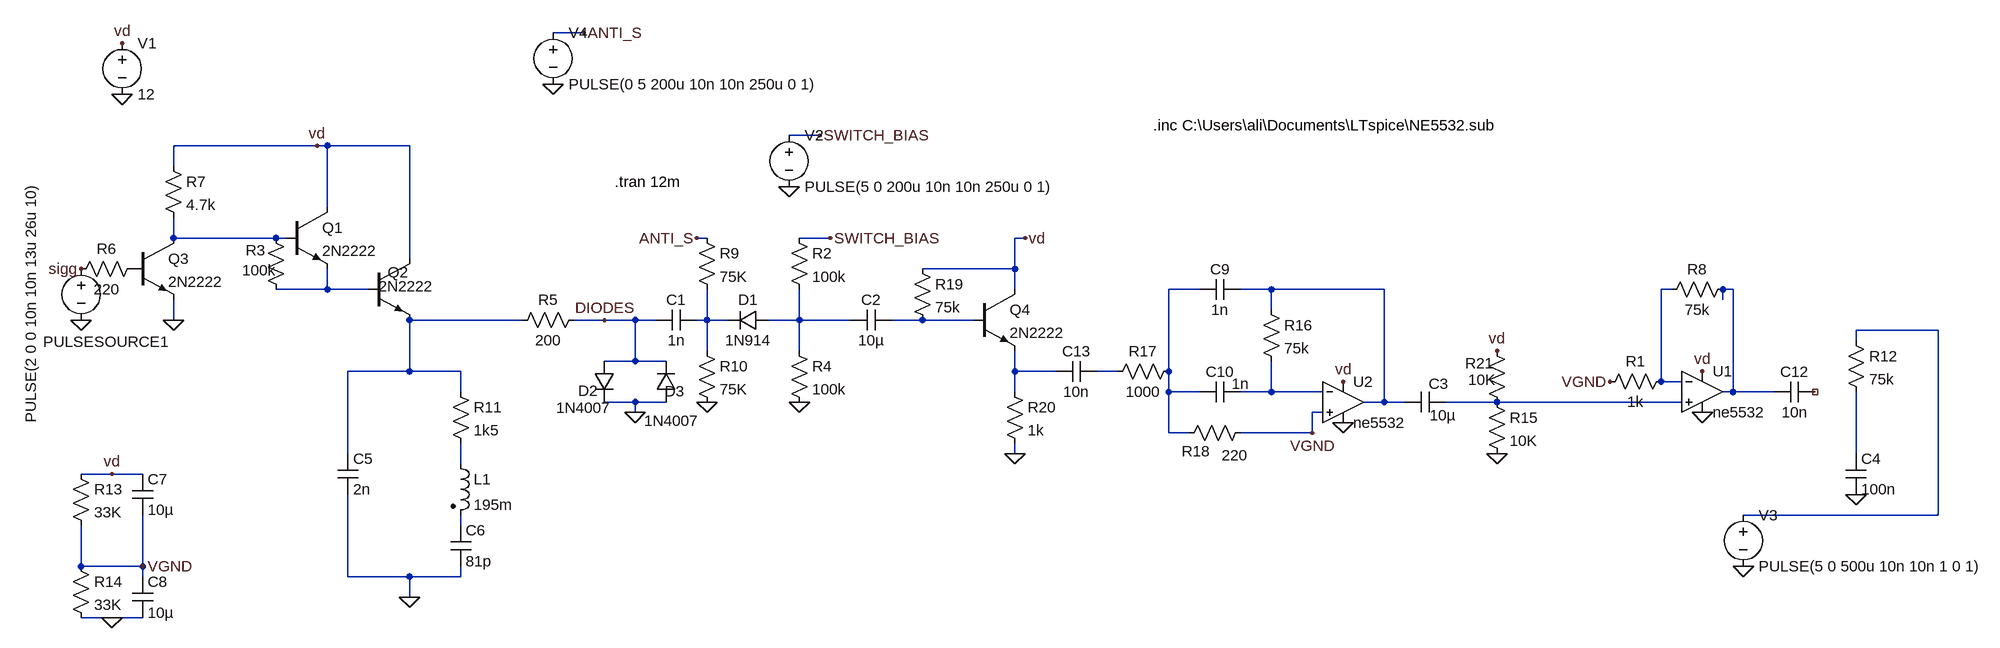
[diagram p0: schematic circuit.asc]
circuit.asc, the LTspice schematic file:
Version 4
SHEET 1 3708 852
WIRE 160 -416 112 -416
WIRE 528 -256 480 -256
WIRE -256 -240 -480 -240
WIRE -240 -240 -256 -240
WIRE -112 -240 -240 -240
WIRE -480 -208 -480 -240
WIRE -240 -144 -240 -240
WIRE -480 -96 -480 -128
WIRE -320 -96 -480 -96
WIRE -304 -96 -320 -96
WIRE 352 -96 336 -96
WIRE 544 -96 496 -96
WIRE 848 -96 832 -96
WIRE -112 -64 -112 -240
WIRE 832 -48 832 -96
WIRE 832 -48 688 -48
WIRE -240 -16 -240 -48
WIRE -240 -16 -320 -16
WIRE -176 -16 -240 -16
WIRE 832 -16 832 -48
WIRE 1120 -16 1072 -16
WIRE 1232 -16 1184 -16
WIRE 1408 -16 1232 -16
WIRE 1856 -16 1840 -16
WIRE 1952 -16 1936 -16
WIRE 1936 0 1936 -16
WIRE 1232 16 1232 -16
WIRE -480 32 -480 0
WIRE 64 32 -112 32
WIRE 192 32 144 32
WIRE 240 32 192 32
WIRE 272 32 240 32
WIRE 352 32 352 -16
WIRE 352 32 336 32
WIRE 384 32 352 32
WIRE 496 32 496 -16
WIRE 496 32 448 32
WIRE 576 32 496 32
WIRE 688 32 640 32
WIRE 768 32 688 32
WIRE 2272 48 2144 48
WIRE 2144 64 2144 48
WIRE 352 80 352 32
WIRE 496 80 496 32
WIRE 240 96 240 32
WIRE 240 96 192 96
WIRE 288 96 240 96
WIRE -112 112 -112 32
WIRE -112 112 -208 112
WIRE -32 112 -112 112
WIRE 832 112 832 80
WIRE 896 112 832 112
WIRE 992 112 960 112
WIRE 1072 112 1072 -16
WIRE 1840 128 1840 -16
WIRE 1872 128 1840 128
WIRE -32 144 -32 112
WIRE 832 144 832 112
WIRE 1072 144 1072 112
WIRE 1120 144 1072 144
WIRE 1232 144 1232 96
WIRE 1232 144 1184 144
WIRE 1312 144 1232 144
WIRE 1952 144 1952 -16
WIRE 1952 144 1936 144
WIRE 2016 144 1952 144
WIRE 240 160 192 160
WIRE 288 160 240 160
WIRE 1408 160 1408 -16
WIRE 1408 160 1376 160
WIRE 1440 160 1408 160
WIRE 1584 160 1504 160
WIRE 1872 160 1584 160
WIRE 240 176 240 160
WIRE 1312 176 1296 176
WIRE 1072 208 1072 144
WIRE 1104 208 1072 208
WIRE 1296 208 1296 176
WIRE 1296 208 1184 208
WIRE -208 240 -208 112
WIRE 832 240 832 224
WIRE 2144 240 2144 144
WIRE -32 256 -32 224
WIRE -576 272 -624 272
WIRE -528 272 -576 272
WIRE 2272 336 2272 48
WIRE 2272 336 1968 336
WIRE -32 352 -32 336
WIRE -624 416 -624 352
WIRE -528 416 -528 336
WIRE -528 416 -624 416
WIRE -528 432 -528 416
WIRE -208 432 -208 304
WIRE -112 432 -208 432
WIRE -32 432 -32 416
WIRE -32 432 -112 432
WIRE -112 464 -112 432
WIRE -576 496 -624 496
WIRE -528 496 -576 496
FLAG -560 -320 0
FLAG -560 -400 vd
FLAG -624 32 0
FLAG 544 -96 SWITCH_BIAS
FLAG 480 -176 0
FLAG 848 -96 vd
FLAG 496 160 0
FLAG 528 -256 SWITCH_BIAS
FLAG 240 176 0
FLAG -480 32 0
FLAG 352 160 0
FLAG -112 464 0
FLAG -624 -48 sigg
FLAG 192 32 DIODES
FLAG 1344 192 0
FLAG 1296 208 VGND
FLAG 832 240 0
FLAG 1904 176 0
FLAG 1760 128 VGND
FLAG 112 -336 0
FLAG 160 -416 ANTI_S
FLAG 336 -96 ANTI_S
FLAG 1344 128 vd
FLAG 1904 112 vd
FLAG -576 496 0
FLAG -576 272 vd
FLAG -528 416 VGND
FLAG 1584 240 0
FLAG 1584 80 vd
FLAG -256 -240 vd
FLAG 1968 416 0
FLAG 2144 304 0
SYMBOL voltage -560 -416 R0
WINDOW 123 0 0 Left 0
WINDOW 39 0 0 Left 0
SYMATTR InstName V1
SYMATTR Value 12
SYMBOL npn -304 -144 R0
SYMATTR InstName Q1
SYMATTR Value 2N2222
SYMBOL voltage -624 -64 R0
WINDOW 0 -59 130 Left 2
WINDOW 3 -79 -115 VRight 2
WINDOW 123 0 0 Left 0
WINDOW 39 0 0 Left 0
SYMATTR InstName PULSESOURCE1
SYMATTR Value PULSE(2 0 0 10n 10n 13u 26u 10)
SYMBOL npn -176 -64 R0
WINDOW 0 30 21 Left 2
WINDOW 3 16 43 Left 2
SYMATTR InstName Q2
SYMATTR Value 2N2222
SYMBOL voltage 480 -272 R0
WINDOW 123 0 0 Left 0
WINDOW 39 0 0 Left 0
SYMATTR InstName V2
SYMATTR Value PULSE(5 0 200u 10n 10n 250u 0 1)
SYMBOL res -336 -112 R0
WINDOW 0 -31 35 Left 2
WINDOW 3 -37 66 Left 2
SYMATTR InstName R3
SYMATTR Value 100k
SYMBOL res 480 64 R0
SYMATTR InstName R4
SYMATTR Value 100k
SYMBOL diode 176 96 R0
WINDOW 0 -25 46 Left 2
WINDOW 3 -59 73 Left 2
SYMATTR InstName D2
SYMATTR Value 1N4007
SYMBOL diode 304 160 R180
WINDOW 0 -13 17 Left 2
WINDOW 3 -35 -29 Left 2
SYMATTR InstName D3
SYMATTR Value 1N4007
SYMBOL cap 640 16 R90
WINDOW 0 0 32 VBottom 2
WINDOW 3 32 32 VTop 2
SYMATTR InstName C2
SYMATTR Value 10µ
SYMBOL res -528 -64 R90
WINDOW 0 0 56 VBottom 2
WINDOW 3 32 56 VTop 2
SYMATTR InstName R6
SYMATTR Value 220
SYMBOL res -496 -224 R0
SYMATTR InstName R7
SYMATTR Value 4.7k
SYMBOL npn -544 -96 R0
SYMATTR InstName Q3
SYMATTR Value 2N2222
SYMBOL res 160 16 R90
WINDOW 0 0 56 VBottom 2
WINDOW 3 32 56 VTop 2
SYMATTR InstName R5
SYMATTR Value 200
SYMBOL res 336 -112 R0
SYMATTR InstName R9
SYMATTR Value 75K
SYMBOL res 336 64 R0
SYMATTR InstName R10
SYMATTR Value 75K
SYMBOL res 480 -112 R0
SYMATTR InstName R2
SYMATTR Value 100k
SYMBOL diode 448 16 R90
WINDOW 0 0 32 VBottom 2
WINDOW 3 32 32 VTop 2
SYMATTR InstName D1
SYMATTR Value 1N914
SYMBOL cap -224 240 R0
SYMATTR InstName C5
SYMATTR Value 2n
SYMBOL cap -48 352 R0
SYMATTR InstName C6
SYMATTR Value 81p
SYMBOL ind2 -48 240 R0
SYMATTR InstName L1
SYMATTR Value 195m
SYMBOL res -48 128 R0
SYMATTR InstName R11
SYMATTR Value 1k5
SYMBOL res 1216 0 R0
SYMATTR InstName R16
SYMATTR Value 75k
SYMBOL cap 1184 -32 R90
WINDOW 0 0 32 VBottom 2
WINDOW 3 32 32 VTop 2
SYMATTR InstName C9
SYMATTR Value 1n
SYMBOL cap 1184 128 R90
WINDOW 0 0 32 VBottom 2
WINDOW 3 -12 0 VTop 2
SYMATTR InstName C10
SYMATTR Value 1n
SYMBOL OpAmps\\opamp2 1344 96 R0
SYMATTR InstName U2
SYMATTR Value ne5532
SYMBOL res 1088 96 R90
WINDOW 0 0 56 VBottom 2
WINDOW 3 32 56 VTop 2
SYMATTR InstName R17
SYMATTR Value 1000
SYMBOL res 1200 192 R90
WINDOW 0 60 86 VBottom 2
WINDOW 3 35 25 VTop 2
SYMATTR InstName R18
SYMATTR Value 220
SYMBOL npn 768 -16 R0
SYMATTR InstName Q4
SYMATTR Value 2N2222
SYMBOL res 672 -64 R0
SYMATTR InstName R19
SYMATTR Value 75k
SYMBOL res 816 128 R0
SYMATTR InstName R20
SYMATTR Value 1k
SYMBOL cap 960 96 R90
WINDOW 0 0 32 VBottom 2
WINDOW 3 32 32 VTop 2
SYMATTR InstName C13
SYMATTR Value 10n
SYMBOL OpAmps\\opamp2 1904 80 R0
SYMATTR InstName U1
SYMATTR Value ne5532
SYMBOL res 1856 112 R90
WINDOW 0 0 56 VBottom 2
WINDOW 3 32 56 VTop 2
SYMATTR InstName R1
SYMATTR Value 1k
SYMBOL res 1952 -32 R90
WINDOW 0 0 56 VBottom 2
WINDOW 3 32 56 VTop 2
SYMATTR InstName R8
SYMATTR Value 75k
SYMBOL voltage 112 -432 R0
WINDOW 123 0 0 Left 0
WINDOW 39 0 0 Left 0
SYMATTR InstName V4
SYMATTR Value PULSE(0 5 200u 10n 10n 250u 0 1)
SYMBOL res -640 256 R0
SYMATTR InstName R13
SYMATTR Value 33K
SYMBOL res -640 400 R0
SYMATTR InstName R14
SYMATTR Value 33K
SYMBOL cap -544 272 R0
SYMATTR InstName C7
SYMATTR Value 10µ
SYMBOL cap -544 432 R0
SYMATTR InstName C8
SYMATTR Value 10µ
SYMBOL res 1568 144 R0
SYMATTR InstName R15
SYMATTR Value 10K
SYMBOL res 1568 64 R0
WINDOW 0 -34 35 Left 2
WINDOW 3 -29 61 Left 2
SYMATTR InstName R21
SYMATTR Value 10K
SYMBOL cap 1504 144 R90
WINDOW 0 3 11 VBottom 2
WINDOW 3 21 5 VTop 2
SYMATTR InstName C3
SYMATTR Value 10µ
SYMBOL cap 2080 128 R90
WINDOW 0 0 32 VBottom 2
WINDOW 3 32 32 VTop 2
SYMATTR InstName C12
SYMATTR Value 10n
SYMBOL cap 336 16 R90
WINDOW 0 0 32 VBottom 2
WINDOW 3 32 32 VTop 2
SYMATTR InstName C1
SYMATTR Value 1n
SYMBOL voltage 1968 320 R0
WINDOW 123 0 0 Left 0
WINDOW 39 0 0 Left 0
SYMATTR InstName V3
SYMATTR Value PULSE(5 0 500u 10n 10n 1 0 1)
SYMBOL res 2128 48 R0
SYMATTR InstName R12
SYMATTR Value 75k
SYMBOL cap 2128 240 R0
SYMATTR InstName C4
SYMATTR Value 100n
TEXT 208 -184 Left 2 !.tran 12m
TEXT 1048 -272 Left 2 !.inc C:\\Users\\ali\\Documents\\LTspice\\NE5532.sub

The netlist it stands for:
* circuit.asc
V1 vd 0 12
Q1 vd N001 N002 0 2N2222
V§PULSESOURCE1 sigg 0 PULSE(2 0 0 10n 10n 13u 26u 10)
Q2 vd N002 N007 0 2N2222
V2 SWITCH_BIAS 0 PULSE(5 0 200u 10n 10n 250u 0 1)
R3 N001 N002 100k
R4 N009 0 100k
D2 DIODES 0 1N4007
D3 0 DIODES 1N4007
C2 N010 N009 10µ
R6 P001 sigg 220
R7 vd N001 4.7k
Q3 N001 P001 0 0 2N2222
R5 DIODES N007 200
R9 ANTI_S N008 75K
R10 N008 0 75K
R2 SWITCH_BIAS N009 100k
D1 N009 N008 1N914
C5 N007 0 2n
C6 N018 0 81p
L1 N017 N018 195m
R11 N007 N017 1k5
R16 N004 N014 75k
C9 N004 N003 1n
C10 N014 N003 1n
XU2 VGND N014 vd 0 N004 ne5532  ; pins In+ In- V+ V- OUT
R17 N003 N013 1000
R18 VGND N003 220
Q4 vd N010 N012 0 2N2222
R19 vd N010 75k
R20 N012 0 1k
C13 N013 N012 10n
XU1 N015 N005 vd 0 N006 ne5532  ; pins In+ In- V+ V- OUT
R1 N005 VGND 1k
R8 N006 N005 75k
V4 ANTI_S 0 PULSE(0 5 200u 10n 10n 250u 0 1)
R13 vd VGND 33K
R14 VGND 0 33K
C7 vd VGND 10µ
C8 VGND 0 10µ
R15 N015 0 10K
R21 vd N015 10K
C3 N015 N004 10µ
C12 NC_01 N006 10n
C1 N008 DIODES 1n
V3 N011 0 PULSE(5 0 500u 10n 10n 1 0 1)
R12 N011 N016 75k
C4 N016 0 100n
.model D D
.lib standard.dio
.model NPN NPN
.model PNP PNP
.lib standard.bjt
.tran 12m
.inc C:\Users\ali\Documents\LTspice\NE5532.sub
.backanno
.end